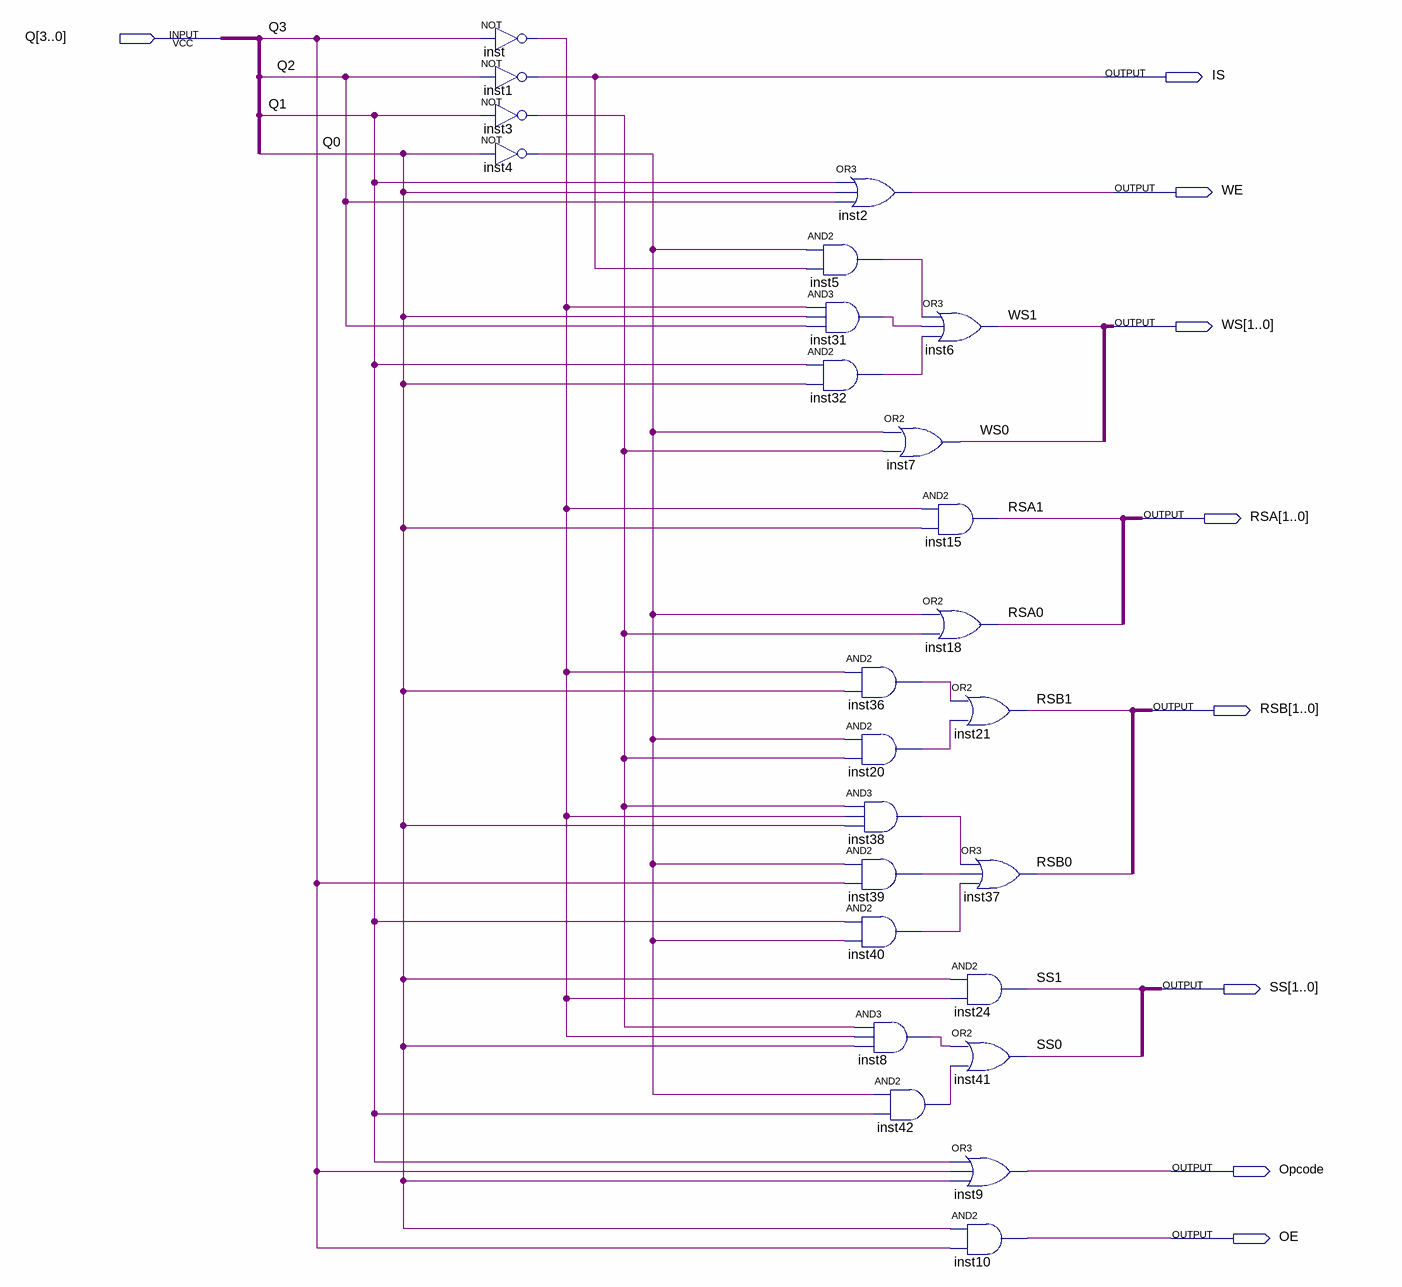
[diagram p0: schematic sheet]
// Quartus schematic OutputLogic.bdf as structural Verilog: 25 symbols, 9 pins
module OutputLogic (
  input  [3:0] Q,
  output IS,
  output WE,
  output [1:0] WS,
  output [1:0] RSA,
  output [1:0] RSB,
  output [1:0] SS,
  output Opcode,
  output OE
);

  wire inst3_out, inst4_out, inst5_out, inst8_out, inst20_out, inst31_out, inst32_out, inst36_out,
       inst38_out, inst39_out, inst40_out, inst42_out, inst_out;

  not inst (inst_out, Q[3]);
  not inst1 (IS, Q[2]);
  not inst3 (inst3_out, Q[1]);
  not inst4 (inst4_out, Q[0]);
  or inst2 (WE, Q[1], Q[0], Q[2]);
  and inst5 (inst5_out, inst4_out, IS);
  and inst31 (inst31_out, inst_out, Q[0], Q[2]);
  and inst32 (inst32_out, Q[1], Q[0]);
  or inst7 (WS[0], inst4_out, inst3_out);
  and inst36 (inst36_out, inst_out, Q[0]);
  and inst20 (inst20_out, inst4_out, inst3_out);
  and inst38 (inst38_out, inst3_out, inst_out, Q[0]);
  and inst39 (inst39_out, inst4_out, Q[3]);
  and inst40 (inst40_out, Q[1], inst4_out);
  and inst8 (inst8_out, inst3_out, inst_out, Q[0]);
  and inst42 (inst42_out, inst4_out, Q[1]);
  or inst6 (WS[1], inst5_out, inst31_out, inst32_out);
  and inst15 (RSA[1], inst_out, Q[0]);
  or inst18 (RSA[0], inst4_out, inst3_out);
  or inst21 (RSB[1], inst36_out, inst20_out);
  or inst37 (RSB[0], inst38_out, inst39_out, inst40_out);
  and inst24 (SS[1], Q[0], inst_out);
  or inst41 (SS[0], inst8_out, inst42_out);
  or inst9 (Opcode, Q[1], Q[3], Q[0]);
  and inst10 (OE, Q[0], Q[3]);
endmodule
